# EAGLE design tssop20 (EAGLE 9.6.2)
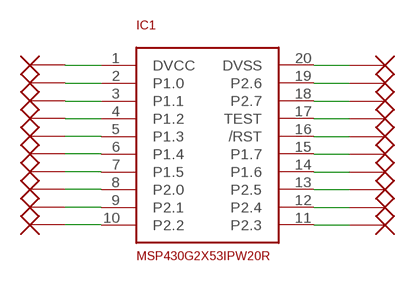
[diagram p0: schematic, sheet 1]

## Parts
IC1  MSP430G2X53IPW20R  [TSSOP20]
P1  PIN  [PIN]
P2  PIN  [PIN]
P3  PIN  [PIN]
P4  PIN  [PIN]
P5  PIN  [PIN]
P6  PIN  [PIN]
P7  PIN  [PIN]
P8  PIN  [PIN]
P9  PIN  [PIN]
P10  PIN  [PIN]
P15  PIN  [PIN]
P16  PIN  [PIN]
P17  PIN  [PIN]
P18  PIN  [PIN]
P19  PIN  [PIN]
P20  PIN  [PIN]
P21  PIN  [PIN]
P22  PIN  [PIN]
P23  PIN  [PIN]
P24  PIN  [PIN]

## Nets
N$1: IC1.1(DVCC) P1.P$1
N$2: IC1.2(P1.0) P2.P$1
N$3: IC1.3(P1.1) P3.P$1
N$4: IC1.4(P1.2) P4.P$1
N$5: IC1.5(P1.3) P5.P$1
N$6: IC1.6(P1.4) P6.P$1
N$7: IC1.7(P1.5) P7.P$1
N$8: IC1.8(P2.0) P8.P$1
N$9: IC1.9(P2.1) P9.P$1
N$10: IC1.10(P2.2) P10.P$1
N$15: IC1.20(DVSS) P15.P$1
N$16: IC1.19(P2.6) P16.P$1
N$17: IC1.18(P2.7) P17.P$1
N$18: IC1.17(TEST) P18.P$1
N$19: IC1.16(/RST) P19.P$1
N$20: IC1.15(P1.7) P20.P$1
N$21: IC1.14(P1.6) P21.P$1
N$22: IC1.13(P2.5) P22.P$1
N$23: IC1.12(P2.4) P23.P$1
N$24: IC1.11(P2.3) P24.P$1

## Library data of the parts
IC1 = Microcontroller-MSP430:MSP430G2X53IPW20R
P1-P10 P15-P24 = Mechanik:PIN

## Board
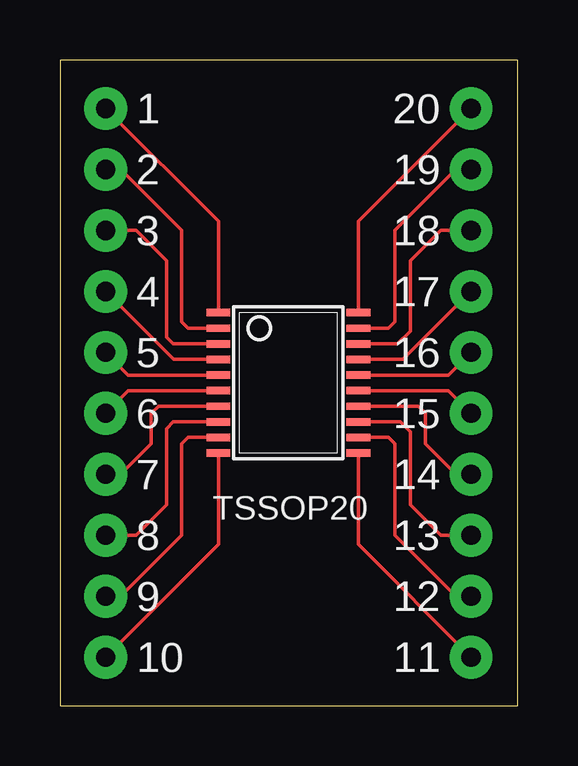
[diagram p1: board, top side]
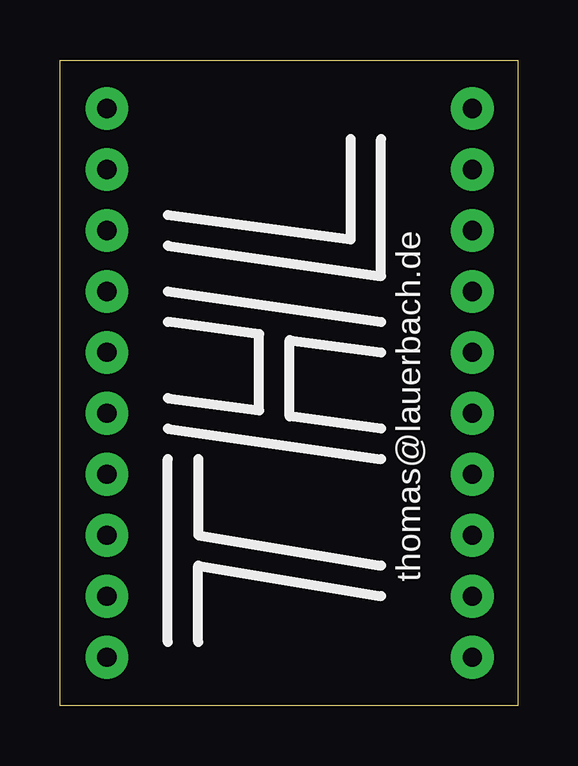
[diagram p2: board, bottom side, seen from below]

Size 19.1 x 26.91 mm. Coordinates in mm from the lower left corner, seen from the top.
Outline: 0,0 19.1,0 19.1,26.91 0,26.91 0,0
Copper layers (1*16): Top 0.035mm / dielectric 1.5mm / Bottom 0.035mm
Design rules "default": minimum track width 6mil, minimum drill 0.35mm, track to track 6mil, track to pad 6mil, pad to pad 6mil, via to via 6mil, smd to smd 6mil, copper to edge 40mil, drill to drill 6mil, minimum pad ring 10mil, minimum via ring 8mil, stop-mask expansion 4mil, vias tented up to drill 0mil, thermal gap 10mil

### Footprints (pad centres in the part's own frame; a part is rotated, then mirrored left to right if it is on the bottom)
TSSOP20 = smd 0.305 x 0.991: 1 -2.925,-2.918; 2 -2.275,-2.918; 3 -1.625,-2.918; 4 -0.975,-2.918; 5 -0.325,-2.918; 6 0.325,-2.918; 7 0.975,-2.918; 8 1.625,-2.918; 9 2.275,-2.918; 10 2.925,-2.918; 11 2.925,2.918; 12 2.275,2.918; 13 1.625,2.918; 14 0.975,2.918; 15 0.325,2.918; 16 -0.325,2.918; 17 -0.975,2.918; 18 -1.625,2.918; 19 -2.275,2.918; 20 -2.925,2.918
PIN = drill 0.8 pad 1.778: P$1 0,0

### Placement (x,y rotation side)
IC1  9.53,13.46 270 top
P1  1.91,24.89 0 top
P2  1.91,22.35 0 top
P3  1.91,19.81 0 top
P4  1.91,17.27 0 top
P5  1.91,14.73 0 top
P6  1.91,12.19 0 top
P7  1.91,9.65 0 top
P8  1.91,7.11 0 top
P9  1.91,4.57 0 top
P10  1.91,2.03 0 top
P15  17.14,24.89 0 top
P16  17.14,22.35 0 top
P17  17.14,19.81 0 top
P18  17.14,17.27 0 top
P19  17.14,14.73 0 top
P20  17.14,12.19 0 top
P21  17.14,9.65 0 top
P22  17.14,7.11 0 top
P23  17.14,4.57 0 top
P24  17.14,2.03 0 top
U$1  [THL]  9.53,12.83 90 bottom

### Tracks (layer width: path | path; a pad name or v marks a point on that pad's centre or on a via)
N$1
  Top 0.152: IC1.1 6.61,20.19 P1.P$1
N$2
  Top 0.152: IC1.2 5.35,15.74 5.08,16 5.08,19.81 2.54,22.35 P2.P$1
N$3
  Top 0.152: IC1.3 4.73,15.09 4.45,15.37 4.45,18.54 3.17,19.81 P3.P$1
N$4
  Top 0.152: IC1.4 4.74,14.44 P4.P$1
N$5
  Top 0.152: IC1.5 2.85,13.79 P5.P$1
N$6
  Top 0.152: IC1.6 2.85,13.14 P6.P$1
N$7
  Top 0.152: IC1.7 4.11,12.49 3.81,12.19 3.81,10.92 2.54,9.65 P7.P$1
N$8
  Top 0.152: IC1.8 4.73,11.84 4.45,11.56 4.45,8.38 3.17,7.11 P8.P$1
N$9
  Top 0.152: IC1.9 5.35,11.19 5.08,10.92 5.08,7.11 2.54,4.57 P9.P$1
N$10
  Top 0.152: IC1.10 6.61,6.73 P10.P$1
N$15
  Top 0.152: IC1.20 12.44,20.19 P15.P$1
N$16
  Top 0.152: IC1.19 13.71,15.74 13.97,16 13.97,19.81 16.51,22.35 P16.P$1
N$17
  Top 0.152: IC1.18 14.07,15.09 14.61,15.62 14.61,18.54 15.88,19.81 P17.P$1
N$18
  Top 0.152: IC1.17 14.31,14.44 P18.P$1
N$19
  Top 0.152: IC1.16 16.2,13.79 P19.P$1
N$20
  Top 0.152: IC1.15 16.2,13.14 P20.P$1
N$21
  Top 0.152: IC1.14 14.95,12.49 15.24,12.19 15.24,10.92 16.51,9.65 P21.P$1
N$22
  Top 0.152: IC1.13 14.2,11.84 14.61,11.43 14.61,8.38 15.88,7.11 P22.P$1
N$23
  Top 0.152: IC1.12 13.71,11.19 13.97,10.92 13.97,7.11 16.51,4.57 P23.P$1
N$24
  Top 0.152: IC1.11 12.44,6.73 P24.P$1

### Text on the board
tNames: 20 | 1 | 19 | 2 | 18 | 3 | 17 | 4 | 16 | 5 | 15 | 6 | 14 | 7 | TSSOP20 | 13 | 8 | 12 | 9 | 11 | 10
bNames: thomas@lauerbach.de